# Altium schematic sheet NFC_Access_NFC_Reader_R00.SchDoc: NFC Access Board
size A4; Author: Hernan M. Travado; CompanyName: UTN FRBA; Revision: 1.0; SheetNumber: 3; SheetTotal: 7
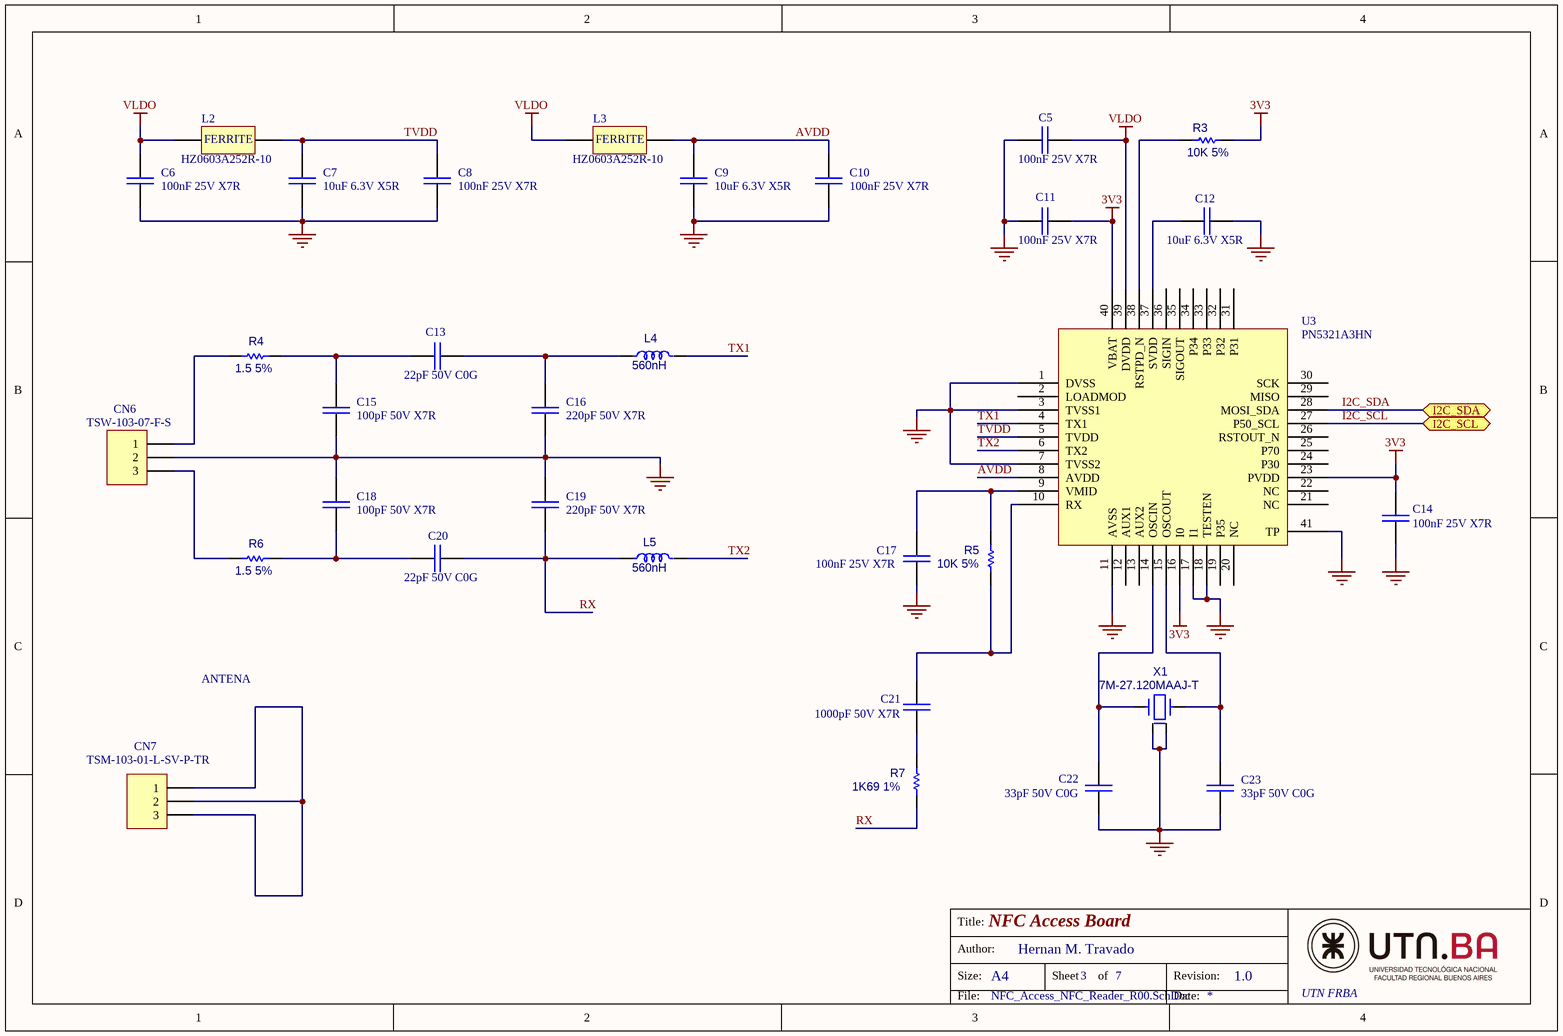
[diagram p0: NFC_Access_NFC_Reader_R00.SchDoc]

## Parts
C5  100nF 25V X7R  [C_0603]
C6  100nF 25V X7R  [C_0603]
C7  10uF 6.3V X5R  [C_0603]
C8  100nF 25V X7R  [C_0603]
C9  10uF 6.3V X5R  [C_0603]
C10  100nF 25V X7R  [C_0603]
C11  100nF 25V X7R  [C_0603]
C12  10uF 6.3V X5R  [C_0603]
C13  22pF 50V C0G  [C_0603]
C14  100nF 25V X7R  [C_0603]
C15  100pF 50V X7R  [C_0603]
C16  220pF 50V X7R  [C_0603]
C17  100nF 25V X7R  [C_0603]
C18  100pF 50V X7R  [C_0603]
C19  220pF 50V X7R  [C_0603]
C20  22pF 50V C0G  [C_0603]
C21  1000pF 50V X7R  [C_0603]
C22  33pF 50V C0G  [C_0603]
C23  33pF 50V C0G  [C_0603]
CN6  TSW-103-07-F-S  [Header_M_1x3_0.1]
CN7  TSM-103-01-L-SV-P-TR  [HEADER_M_1x3_0.1"_SMD]
L2  HZ0603A252R-10  [F_0603]
L3  HZ0603A252R-10  [F_0603]
L4  560nH  [I_0603]
L5  560nH  [I_0603]
R3  10K 5%  [R_0603]
R4  1.5 5%  [R_0603]
R5  10K 5%  [R_0603]
R6  1.5 5%  [R_0603]
R7  1K69 1%  [R_0603]
U3  PN5321A3HN  [QFN40G-0.5-6X6MM]
X1  7M-27.120MAAJ-T  [7M-4-SMD]

## Ports
I2C_SCL (bidir, see NFC_Access_MainPage_R00[3B], NFC_Access_CPU1_R00[1B]), I2C_SDA (bidir, see NFC_Access_MainPage_R00[3B], NFC_Access_CPU1_R00[1B])

## Nets
3V3: C11.1 C14.1 R3.1 U3.16(I0) U3.23(PVDD) U3.40(VBAT)
GND: C5.2 C6.2 C7.1 C8.2 C9.1 C10.2 C11.2 C12.2 C14.2 C15.2 C16.2 C17.2 C18.1 C19.1 C22.2 C23.2 CN6.2 U3.1(DVSS) U3.3(TVSS1) U3.7(TVSS2) U3.11(AVSS) U3.17(I1) U3.18(TESTEN) U3.41(TP) X1.2 X1.4
VLDO: C5.1 C6.1 L2.1 L3.1 U3.39(DVDD)
AVDD: C9.2 C10.1 L3.2 U3.8(AVDD)
I2C_SCL: U3.27(P50_SCL) ; port I2C_SCL
I2C_SDA: U3.28(MOSI_SDA) ; port I2C_SDA
RX: C19.2 C20.2 L5.1 R7.2
TVDD: C7.2 C8.1 L2.2 U3.5(TVDD)
TX1: L4.2 U3.4(TX1)
TX2: L5.2 U3.6(TX2)
NetC12_1: C12.1 U3.37(SVDD)
NetC13_1: C13.1 C15.1 R4.2
NetC13_2: C13.2 C16.1 L4.1
NetC17_1: C17.1 R5.1 U3.9(VMID)
NetC18_2: C18.2 C20.1 R6.2
NetC21_1: C21.1 R5.2 U3.10(RX)
NetC21_2: C21.2 R7.1
NetC22_1: C22.1 U3.14(OSCIN) X1.3
NetC23_1: C23.1 U3.15(OSCOUT) X1.1
NetCN6_1: CN6.1 R4.1
NetCN6_3: CN6.3 R6.1
NetCN7_1: CN7.1 CN7.2 CN7.3
NetR3_2: R3.2 U3.38(RSTPD_N)

Not connected (* = marked no-connect by the designer): U3 2(LOADMOD) 12(AUX1) 13(AUX2) 19(P35) 20(NC) 21(NC) 22(NC) 24(P30) 25(P70) 26(RSTOUT_N) 29(MISO) 30(SCK) 31(P31) 32(P32) 33(P33) 34(P34) 35(SIGOUT) 36(SIGIN)

## Notes on the sheet
- ANTENA
- Title:
- Size:
- Author:
- A4
- Sheet
- of
- Revision:
- File:
- Date:

## Library data of the parts
C5 C6 C8 C10 C11 C14 C17 C21 = Ceramic capacitor: Ceramic Capacitor / 1276-1018-2-ND
C7 C9 C12 = Ceramic capacitor: Ceramic Capacitor / 1276-1119-2-ND
C13 C20 = Ceramic capacitor: Ceramic Capacitor / 1276-2228-2-ND
C15 C18 = Ceramic capacitor: Ceramic Capacitor / 1276-1908-2-ND
C16 C19 = Ceramic capacitor: Ceramic Capacitor / 1276-1986-2-ND
C22 C23 = Ceramic capacitor: Ceramic Capacitor / 1276-1070-2-ND
CN6 = CONN_03P: CONN HEADER VERT 3POS 2.54MM / SAM8995-ND
CN7 = CONN_03P: CONN HEADER SMD 3POS 2.54MM / SAM13281TR-ND
L2 L3 = FERRITE: Ferrite Bead / 240-2561-2-ND
L4 L5 = IND: FIXED IND 560NH 450MA 480MOHM SM / 490-LQW18CNR56J0ZDTR-ND
R3 R5 = Res1: Resistor / CR0603-JW-103ELFTR-ND
R4 R6 = Res1: Resistor SMD 0603 / CR0603-J/-1R5ELFTR-ND
R7 = Res1: Resistor / CR0603-FX-1691ELFTR-ND
U3 = PN532: NFC Controller / 568-13228-ND
X1 = CRYSTAL_4P: Crystal 4 Vias + GND 27.12 MHz / 887-1424-2-ND